# Altium schematic sheet Display.SchDoc
size A4; SheetNumber: 11; SheetTotal: 11
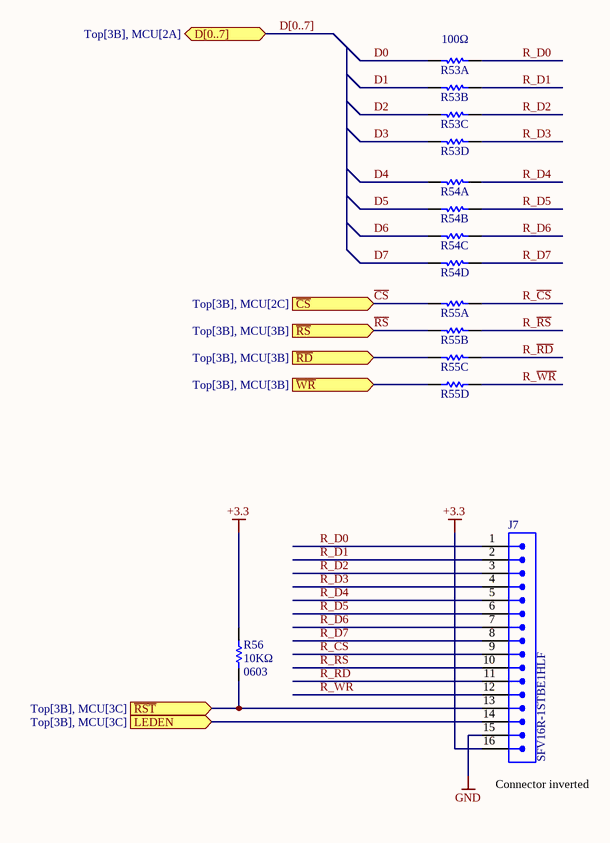
[diagram p0: Display.SchDoc]

## Parts
J7  SFV16R-1STBE1HLF  [FFC16POS]
R53  value 100Ω  [1206]  (hidden comment: YC164-JR-07100RL)  (parts A,B,C,D of 4)
R54  YC164-JR-07100RL  [1206]  (value not drawn)  (parts A,B,C,D of 4)
R55  YC164-JR-07100RL  [1206]  (value not drawn)  (parts A,B,C,D of 4)
R56  value 10KΩ  [0603]  (hidden comment: RMCF0603FG10K0)

## Ports
D[0..7] (bidir, see Top[3B], MCU[2A]), LEDEN (in, see Top[3B], MCU[3C]), ~{CS} (in, see Top[3B], MCU[2C]), ~{RD} (in, see Top[3B], MCU[3B]), ~{RST} (in, see Top[3B], MCU[3C]), ~{RS} (in, see Top[3B], MCU[3B]), ~{WR} (in, see Top[3B], MCU[3B])

## Nets
+3.3: J7.16 R56.2
GND: J7.15
~{CS}: R55.8 ; port ~{CS}
D0: R53.8
D1: R53.7
D2: R53.6
D3: R53.5
D4: R54.8
D5: R54.7
D6: R54.6
D7: R54.5
LEDEN: J7.14 ; port LEDEN
~{RD}: R55.6 ; port ~{RD}
~{RS}: R55.7 ; port ~{RS}
~{RST}: J7.13 R56.1 ; port ~{RST}
R_~{CS}: J7.9 R55.1
R_D0: J7.1 R53.1
R_D1: J7.2 R53.2
R_D2: J7.3 R53.3
R_D3: J7.4 R53.4
R_D4: J7.5 R54.1
R_D5: J7.6 R54.2
R_D6: J7.7 R54.3
R_D7: J7.8 R54.4
R_~{RD}: J7.11 R55.3
R_~{RS}: J7.10 R55.2
R_~{WR}: J7.12 R55.4
~{WR}: R55.5 ; port ~{WR}

## Buses and harness runs
bus D[0..7] = port D[0..7]

## Notes on the sheet
- (near J7) Connector inverted

## Library data of the parts
J7 = SFV16R-1STBE1HLF: 16 Position FFC, FPC Connector Contacts, Bottom 0.020" (0.50mm) Surface Mount, Right Angle
R53 = YC164-JR-07100RL: 100 Ohm ±5% 62.5mW Power Per Element Isolated 4 Resistor Network/Array ±200ppm/°C 1206 (3216 Metric), Convex, Long Side Terminals; Tolerance: ±5%; Power: 62.5mW; Case: 1206
R54 R55 = YC164-JR-07100RL: 100 Ohm ±5% 62.5mW Power Per Element Isolated 4 Resistor Network/Array ±200ppm/°C 1206 (3216 Metric), Convex, Long Side Terminals; Value: 100Ω; Tolerance: ±5%; Power: 62.5mW; Case: 1206
R56 = RMCF0603FG10K0: 10 kOhms ±1% 0.1W, 1/10W Chip Resistor 0603 (1608 Metric) Automotive AEC-Q200 Thick Film; Case: 0603; Tolerance: 1%; Power: 0.1W